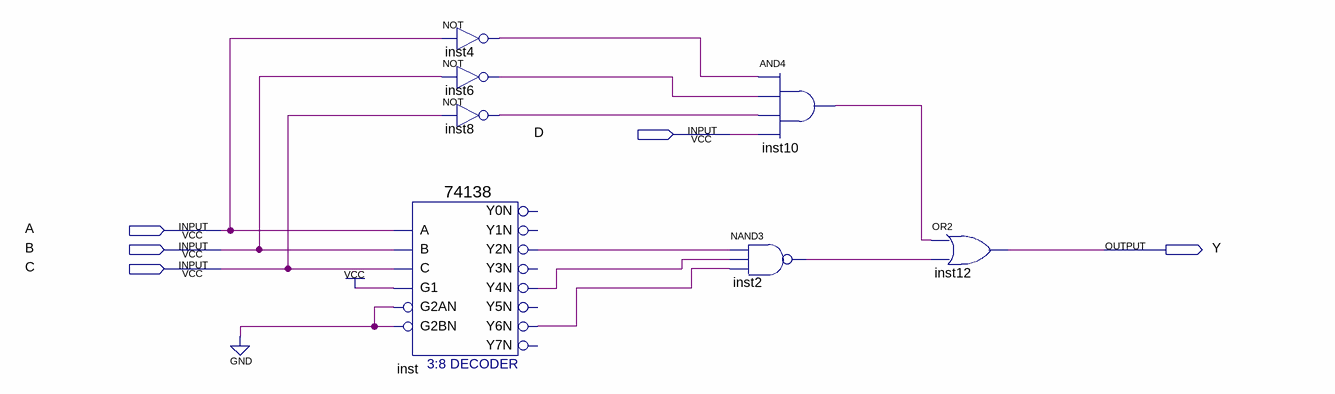
[diagram p0: schematic sheet]
// Quartus schematic 74LS138_simplified.bdf as structural Verilog: 7 symbols, 5 pins
module \74LS138_simplified  (
  input  D,
  input  A,
  input  B,
  input  C,
  output Y
);

  wire inst2_out, inst4_out, inst6_out, inst8_out, inst10_out, inst_y2n, inst_y4n, inst_y6n;

  \74138  inst (
    .A(A), .B(B), .G1(1'b1), .C(C), .G2AN(1'b0), .G2BN(1'b0), .Y2N(inst_y2n), .Y4N(inst_y4n), .Y6N(inst_y6n));  // open: Y0N, Y1N, Y3N, Y5N, Y7N
  not inst4 (inst4_out, A);
  not inst6 (inst6_out, B);
  not inst8 (inst8_out, C);
  and inst10 (inst10_out, inst4_out, inst6_out, inst8_out, D);
  nand inst2 (inst2_out, inst_y2n, inst_y4n, inst_y6n);
  or inst12 (Y, inst10_out, inst2_out);
endmodule
